# Altium project DCCAccDecoder.PrjPCB
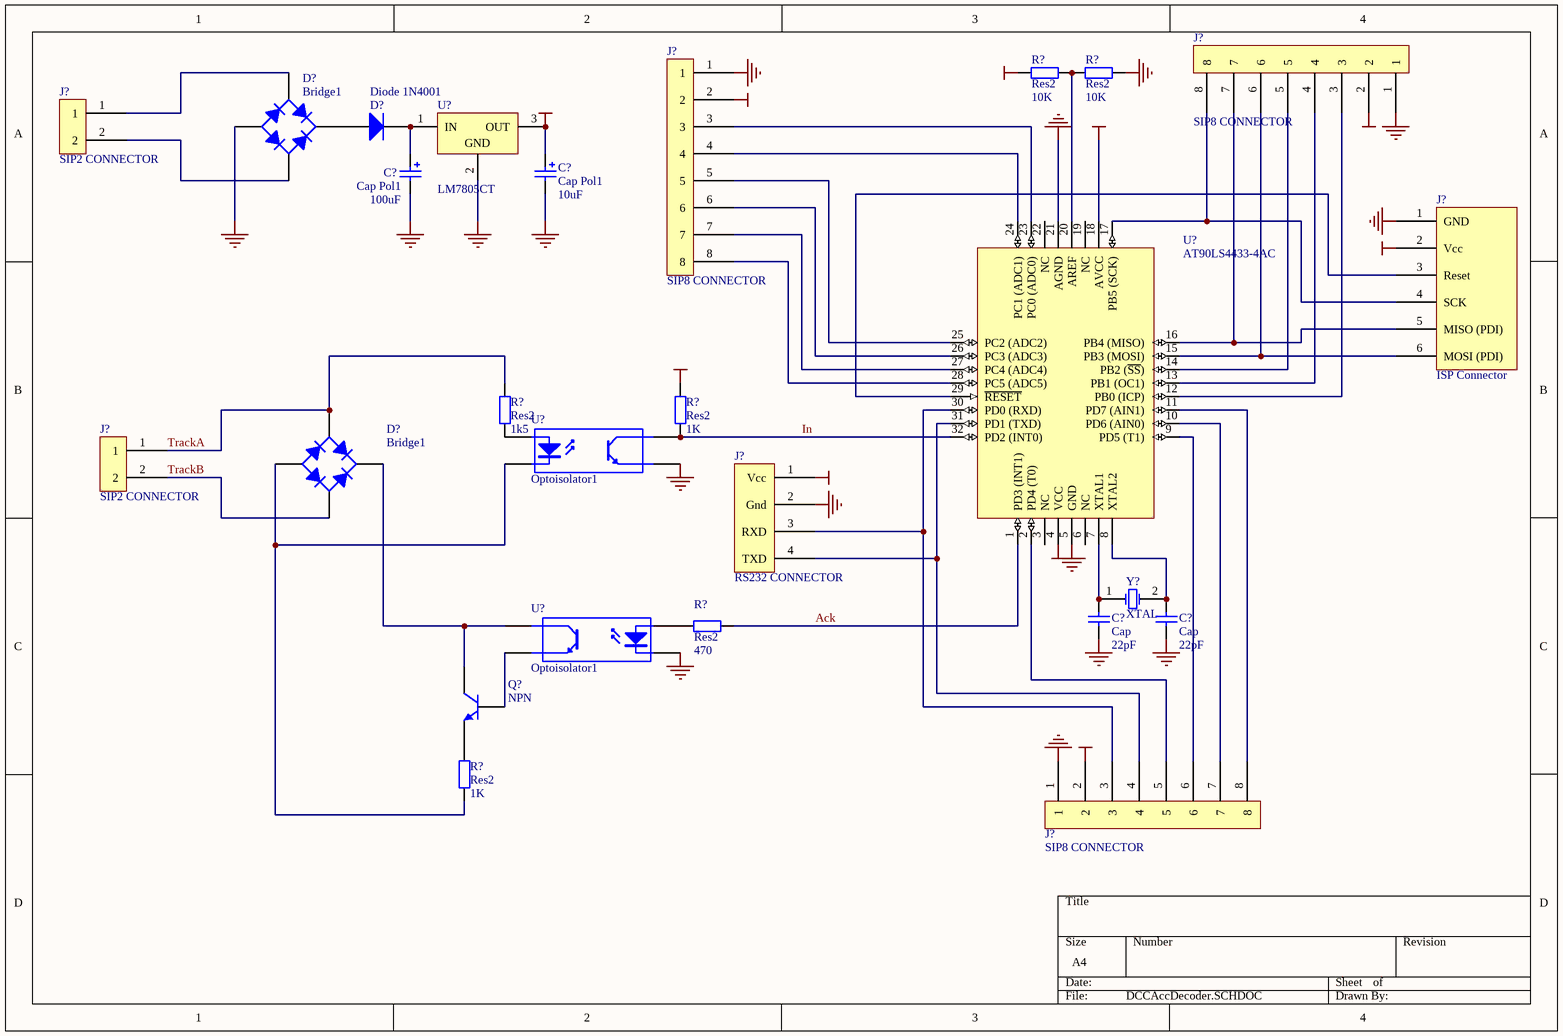
[diagram p0: DCCAccDecoder.SCHDOC]
1 sheet, 26 parts. Net scope: global (net labels, ports and power ports of the same name join across sheets).

## Sheet DCCAccDecoder.SCHDOC
size A4

### Parts
(Parts that share a designator on the sheet are numbered #1, #2 ... from top to bottom, then left to right.)
C?#1  Cap Pol1  value 100uF  [RB7.6-15]
C?#2  Cap Pol1  value 10uF  [RB7.6-15]
C?#3  Cap  value 22pF  [RAD-0.3]
C?#4  Cap  value 22pF  [RAD-0.3]
D?#1  Bridge1  [E-BIP-P4/D10]
D?#2  Diode 1N4001  [DIO10.46-5.3x2.8]
D?#3  Bridge1  [E-BIP-P4/D10]
J?#1  SIP8 CONNECTOR  [0.1 SIP 8 PIN]
J?#2  SIP2 CONNECTOR  [0.1 SIP 2 PIN]
J?#3  SIP8 CONNECTOR  [0.1 SIP 8 PIN]
J?#4  ISP Connector  [0.1 SIP 6 PIN]
J?#5  SIP2 CONNECTOR  [0.1 SIP 2 PIN]
J?#6  RS232 CONNECTOR  [0.1 SIP 4 PIN]
J?#7  SIP8 CONNECTOR  [0.1 SIP 8 PIN]
Q?  NPN  [BCY-W3]
R?#1  Res2  value 10K  [AXIAL-0.4]
R?#2  Res2  value 10K  [AXIAL-0.4]
R?#3  Res2  value 1k5  [AXIAL-0.4]
R?#4  Res2  value 1K  [AXIAL-0.4]
R?#5  Res2  value 470  [AXIAL-0.4]
R?#6  Res2  value 1K  [AXIAL-0.4]
U?#1  LM7805CT  [T03B]
U?#2  AT90LS4433-4AC  [32A]
U?#3  Optoisolator1  [DIP-4]
U?#4  Optoisolator1  [DIP-4]
Y?  XTAL  [BCY-W2/D3.1]

### Nets
GND: C?#1.2 C?#2.2 C?#3.1 C?#4.1 D?#1.1(A) J?#1.1 J?#3.1 J?#4.1(GND) J?#6.2(Gnd) J?#7.1 R?#2.2 U?#1.2(GND) U?#2.5(GND) U?#2.21(AGND) U?#3.4(E) U?#4.2(K)
VCC: C?#2.1 J?#1.2 J?#3.2 J?#4.2(Vcc) J?#6.1(Vcc) J?#7.2 R?#1.1 R?#4.2 U?#1.3(OUT) U?#2.4(VCC) U?#2.18(AVCC)
Ack: R?#5.2 U?#2.1(PD3_(INT1))
In: R?#4.1 U?#2.32(PD2_(INT0)) U?#3.3(C)
TrackA: D?#3.2(C) J?#5.1 R?#3.2
TrackB: D?#3.4(C) J?#5.2
NetC?#1_1: C?#1.1 D?#2.2(K) U?#1.1(IN)
NetC?#3_2: C?#3.2 U?#2.7(XTAL1) Y?.1(OSC1)
NetC?#4_2: C?#4.2 U?#2.8(XTAL2) Y?.2(OSC2)
NetD?#1_2: D?#1.2(C) J?#2.1
NetD?#1_3: D?#1.3(K) D?#2.1(A)
NetD?#1_4: D?#1.4(C) J?#2.2
NetD?#3_1: D?#3.1(A) R?#6.2 U?#3.2(K)
NetD?#3_3: D?#3.3(K) Q?.1(C) U?#4.3(C)
NetJ?#1_3: J?#1.3 U?#2.23(PC0_(ADC0))
NetJ?#1_4: J?#1.4 U?#2.24(PC1_(ADC1))
NetJ?#1_5: J?#1.5 U?#2.25(PC2_(ADC2))
NetJ?#1_6: J?#1.6 U?#2.26(PC3_(ADC3))
NetJ?#1_7: J?#1.7 U?#2.27(PC4_(ADC4))
NetJ?#1_8: J?#1.8 U?#2.28(PC5_(ADC5))
NetJ?#3_3: J?#3.3 U?#2.12(PB0_(ICP))
NetJ?#3_4: J?#3.4 U?#2.13(PB1_(OC1))
NetJ?#3_5: J?#3.5 U?#2.14(PB2_(~{SS}))
NetJ?#3_6: J?#3.6 J?#4.6(MOSI_(PDI)) U?#2.15(PB3_(MOSI))
NetJ?#3_7: J?#3.7 J?#4.5(MISO_(PDI)) U?#2.16(PB4_(MISO))
NetJ?#3_8: J?#3.8 J?#4.4(SCK) U?#2.17(PB5_(SCK))
NetJ?#4_3: J?#4.3(Reset) U?#2.29(~{RESET})
NetJ?#6_3: J?#6.3(RXD) J?#7.3 U?#2.30(PD0_(RXD))
NetJ?#6_4: J?#6.4(TXD) J?#7.4 U?#2.31(PD1_(TXD))
NetJ?#7_5: J?#7.5 U?#2.2(PD4_(T0))
NetJ?#7_6: J?#7.6 U?#2.9(PD5_(T1))
NetJ?#7_7: J?#7.7 U?#2.10(PD6_(AIN0))
NetJ?#7_8: J?#7.8 U?#2.11(PD7_(AIN1))
NetQ?_2: Q?.2(B) U?#4.4(E)
NetQ?_3: Q?.3(E) R?#6.1
NetR?#1_2: R?#1.2 R?#2.1 U?#2.20(AREF)
NetR?#3_1: R?#3.1 U?#3.1(A)
NetR?#5_1: R?#5.1 U?#4.1(A)

Not connected (* = marked no-connect by the designer): U?#2 3(NC) 6(NC) 19(NC) 22(NC)

### Library data of the parts
C?#1 C?#2 = Cap Pol1: Polarized Capacitor (Radial); Published: 8-Jun-2000; Revision: July-2002: Re-released for DXP Platform.; Publisher: Altium Limited
C?#3 C?#4 = Cap: Capacitor; Published: 8-Jun-2000; Revision: July-2002: Re-released for DXP Platform.; Publisher: Altium Limited
D?#1 D?#3 = Bridge1: Full Wave Diode Bridge; Published: 8-Jun-2000; Revision: July-2002: Re-released for DXP Platform.; Publisher: Altium Limited
D?#2 = Diode 1N4001: 1 Amp General Purpose Rectifier; Revision 1: 11-Jul-2000: SIM Model Added.; Revision 2: 17-Jul-2002: Re-released for DXP Platform.; Package Information: Latest Revision: Aug-1999; Code - JEDEC: DO-204-AL; Published: 8-Jun-2000; Datasheet: Latest Revision: 1998; Package Reference: DO-41; Publisher: Altium Limited
Q? = NPN: NPN Bipolar Transistor; Code - JEDEC: TO-226-AA; Published: 8-Jun-2000; Revision: July-2002: Re-released for DXP Platform.; Publisher: Altium Limited
R?#1-R?#6 = Res2: Resistor; Published: 8-Jun-2000; Revision: July-2002: Re-released for DXP Platform.; Publisher: Altium Limited
U?#1 = LM7805CT: Series 3-Terminal Positive Regulator; Package Information: Latest Revision: 1995; Note: Tab is connected to GND; Published: 15-Apr-2002; Datasheet: Latest Revision: May-1999; Package Reference: T03B; Publisher: Altium Limited
U?#2 = AT90LS4433-4AC: 8-Bit AVR Microcontroller with 4K Bytes of In-System Programmable Flash Memory; Package Information: Latest Revision: revB, Oct-2001; Code - JEDEC: MS-026-ABA; Published: 17-Sep-2003; Datasheet: Latest Revision: 1042G-AVR-09/02; Package Reference: 32A; Publisher: Altium Limited
U?#3 U?#4 = Optoisolator1: Optoisolator; Published: 24-Mar-1999; Revision: July-2002: Re-released for DXP Platform.; Publisher: Altium Limited
Y? = XTAL: Crystal Oscillator; Published: 8-Jun-2000; Revision: July-2002: Re-released for DXP Platform.; Publisher: Altium Limited